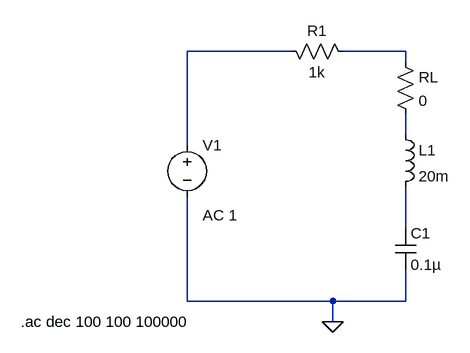
[diagram p0: schematic bsf_ltspice.asc]
bsf_ltspice.asc, the LTspice schematic file:
Version 4
SHEET 1 880 680
WIRE 240 16 80 16
WIRE 416 16 320 16
WIRE 416 32 416 16
WIRE 416 144 416 112
WIRE 80 160 80 16
WIRE 416 288 416 224
WIRE 80 400 80 240
WIRE 304 400 80 400
WIRE 416 400 416 352
WIRE 416 400 304 400
WIRE 304 432 304 400
FLAG 304 432 0
SYMBOL res 224 0 M90
WINDOW 0 0 56 VBottom 2
WINDOW 3 32 56 VTop 2
SYMATTR InstName R1
SYMATTR Value 1k
SYMBOL voltage 80 144 R0
WINDOW 123 24 124 Left 2
WINDOW 39 0 0 Left 0
SYMATTR Value2 AC 1
SYMATTR InstName V1
SYMATTR Value ""
SYMBOL ind 400 128 R0
SYMATTR InstName L1
SYMATTR Value 20m
SYMBOL cap 400 288 R0
SYMATTR InstName C1
SYMATTR Value 0.1µ
SYMBOL res 400 16 R0
SYMATTR InstName RL
SYMATTR Value 0
TEXT -176 432 Left 2 !.ac dec 100 100 100000

The netlist it stands for:
* bsf_ltspice.asc
R1 N001 N002 1k
V1 N001 0 AC 1
L1 N003 N004 20m
C1 N004 0 0.1µ
RL N002 N003 0
.ac dec 100 100 100000
.backanno
.end